# Altium schematic sheet mA.SchDoc
size A4
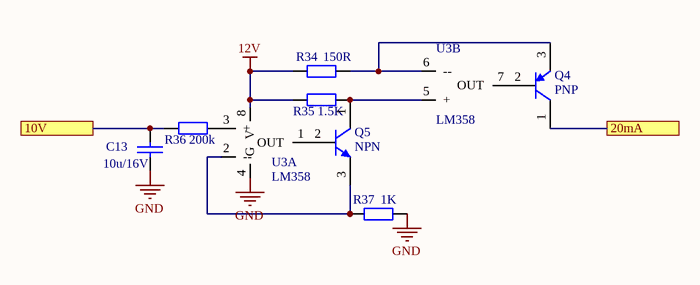
[diagram p0: mA.SchDoc]

## Parts
C13  10u/16V  [1206]
Q4  PNP  [SOT23]
Q5  NPN  [SOT23]
R34  150R  [0805R]
R35  1.5K  [0805R]
R36  200k  [0805R]
R37  1K  [0805R]
U3  LM358  [SOP-08]  (parts A,B of 2)

## Ports
10V, 20mA

## Nets
12V: R34.2 R35.2 U3.8(V)
GND: C13.2 R37.1 U3.4(G)
10V: C13.1 R36.2 ; port 10V
20mA: Q4.1(C) ; port 20mA
NetQ4_2: Q4.2(B) U3.7(OUT)
NetQ4_3: Q4.3(E) R34.1 U3.6(--)
NetQ5_1: Q5.1(C) R35.1 U3.5(+)
NetQ5_2: Q5.2(B) U3.1(OUT)
NetQ5_3: Q5.3(E) R37.2 U3.2(--)
NetR36_1: R36.1 U3.3(+)

## Library data of the parts
C13 = CAP: Capacitor; 采购信息: 1uF 25V X7R,5%,50V,贴片电容 0805
Q4 = PNP: PNP Bipolar Transistor; Published: 8-Jun-2000; LatestRevisionDate: 17-Jul-2002; LatestRevisionNote: Re-released for DXP Platform.; PackageReference: SOT-23B; Publisher: Altium Limited; Code_JEDEC: SOT-23
Q5 = NPN: NPN Bipolar Transistor; Published: 8-Jun-2000; LatestRevisionDate: 17-Jul-2002; LatestRevisionNote: Re-released for DXP Platform.; PackageReference: TO-226; Publisher: Altium Limited; Code_JEDEC: TO-226-AA
R34-R36 = Res2: Resistor; Value: 1K; Published: 8-Jun-2000; LatestRevisionDate: 17-Jul-2002; LatestRevisionNote: Re-released for DXP Platform.; PackageReference: AXIAL-0.4; Publisher: Altium Limited; PackageDescription: Axial Device, Thru-Hole; 2 Leads; 0.4 in Pin Spacing
R37 = Res2: Resistor; Published: 8-Jun-2000; LatestRevisionDate: 17-Jul-2002; LatestRevisionNote: Re-released for DXP Platform.; PackageReference: AXIAL-0.4; Publisher: Altium Limited; PackageDescription: Axial Device, Thru-Hole; 2 Leads; 0.4 in Pin Spacing; Value: 1K
U3 = LM358: 采购信息: 贴片 LM358